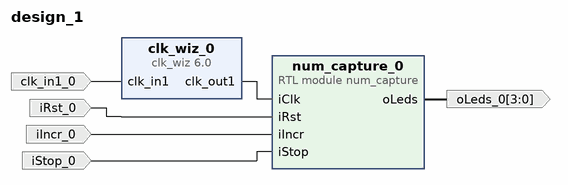
[diagram p0: block diagram of the top level]
# Vivado block design design_1, xc7z020clg400-1, Vivado 2020.1
create_bd_design design_1

create_bd_port -dir O -from 3 -to 0 oLeds_0
create_bd_port -dir I -type clk clk_in1_0
create_bd_port -dir I iRst_0
create_bd_port -dir I iIncr_0
create_bd_port -dir I iStop_0

create_bd_cell -type module -reference num_capture num_capture_0
create_bd_cell -type ip -vlnv xilinx.com:ip:clk_wiz:6.0 clk_wiz_0
set_property -dict [list \
  CONFIG.CLKOUT1_JITTER 181.828 \
  CONFIG.CLKOUT1_PHASE_ERROR 104.359 \
  CONFIG.CLKOUT1_REQUESTED_OUT_FREQ 25 \
  CONFIG.MMCM_CLKFBOUT_MULT_F 9.125 \
  CONFIG.MMCM_CLKOUT0_DIVIDE_F 36.500 \
  CONFIG.USE_RESET false \
] [get_bd_cells clk_wiz_0]

# ---- connections ----

connect_bd_net [get_bd_pins num_capture_0/oLeds] [get_bd_ports oLeds_0]
connect_bd_net -net iRst_0_1 [get_bd_ports iRst_0] [get_bd_pins num_capture_0/iRst]
connect_bd_net -net iIncr_0_1 [get_bd_ports iIncr_0] [get_bd_pins num_capture_0/iIncr]
connect_bd_net -net iStop_0_1 [get_bd_ports iStop_0] [get_bd_pins num_capture_0/iStop]
connect_bd_net [get_bd_pins clk_wiz_0/clk_out1] [get_bd_pins num_capture_0/iClk]
connect_bd_net -net clk_in1_0_1 [get_bd_ports clk_in1_0] [get_bd_pins clk_wiz_0/clk_in1]

validate_bd_design
save_bd_design
